# Altium schematic sheet Buffer.SchDoc
size A4
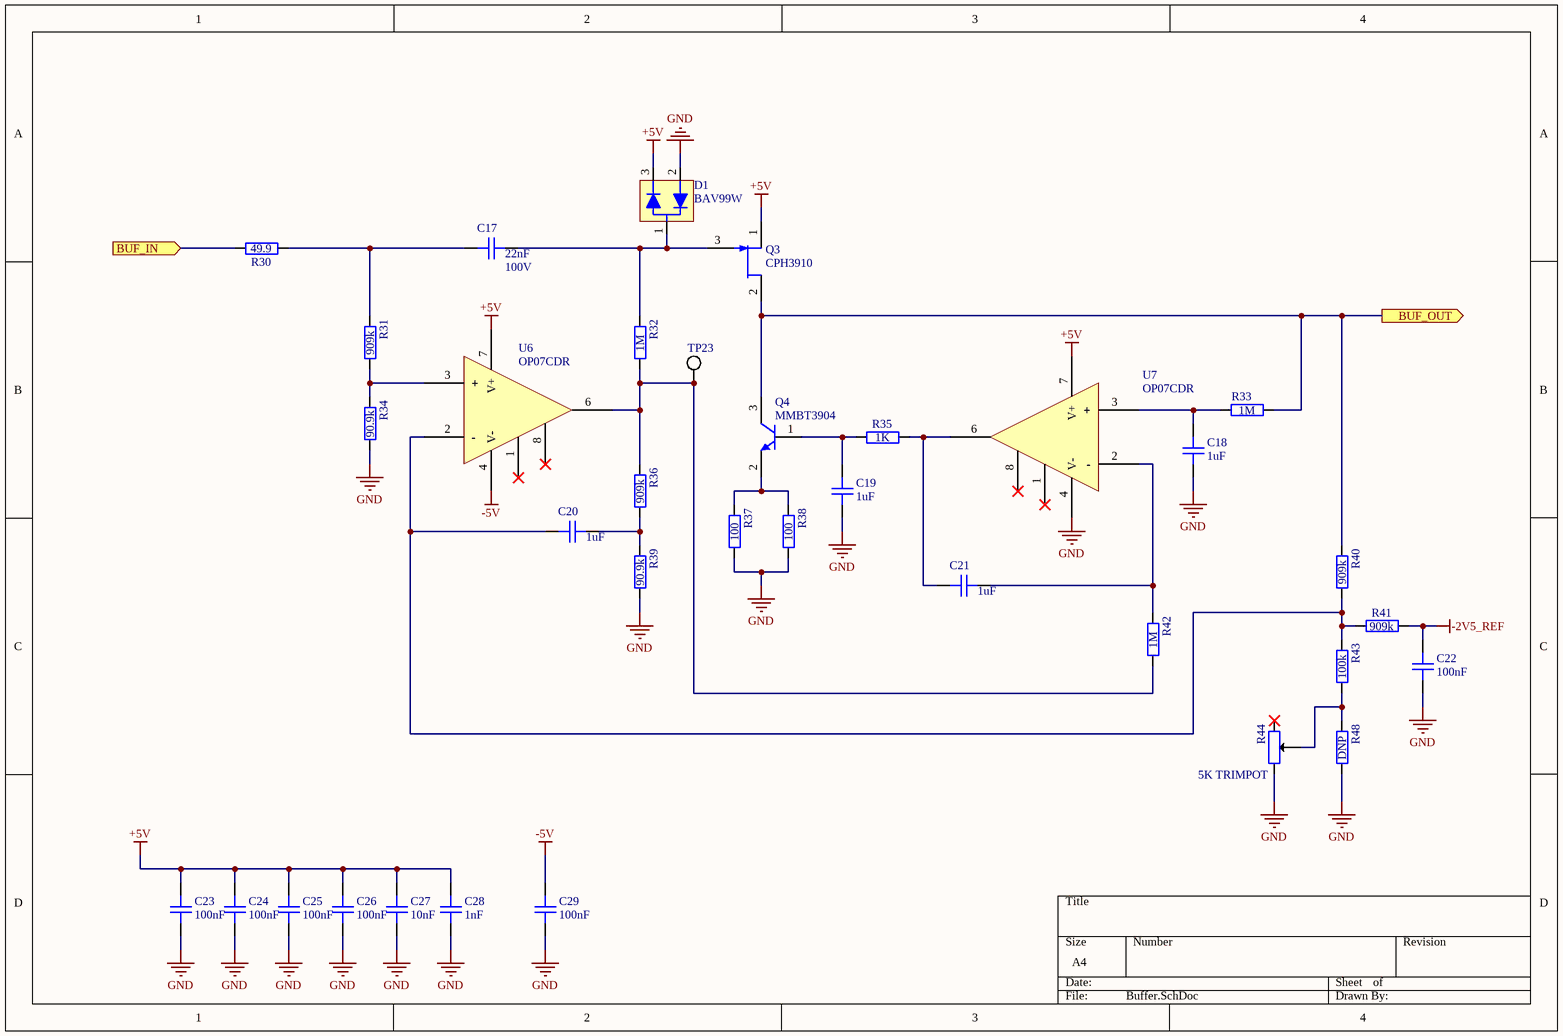
[diagram p0: Buffer.SchDoc]

## Parts
C17  22nF  Voltage Rating: 100V  [GEN_C_0603]
C18  1uF  [GEN_C_0402]
C19  1uF  [GEN_C_0402]
C20  1uF  [GEN_C_0402]
C21  1uF  [GEN_C_0402]
C22  100nF  [GEN_C_0402]
C23  100nF  [GEN_C_0402]
C24  100nF  [GEN_C_0402]
C25  100nF  [GEN_C_0402]
C26  100nF  [GEN_C_0402]
C27  10nF  [GEN_C_0402]
C28  1nF  [GEN_C_0402]
C29  100nF  [GEN_C_0402]
D1  BAV99W  [GEN_SOT_323]
Q3  CPH3910  [ON_SOT23_CPH3]
Q4  MMBT3904  [MMC_SOT23]
R30  49.9  [GEN_R_0402]
R31  909k  [GEN_R_0402]
R32  1M  [GEN_R_0402]
R33  1M  [GEN_R_0402]
R34  90.9k  [GEN_R_0402]
R35  1K  [GEN_R_0402]
R36  909k  [GEN_R_0402]
R37  100  [GEN_R_0402]
R38  100  [GEN_R_0402]
R39  90.9k  [GEN_R_0402]
R40  909k  [GEN_R_0402]
R41  909k  [GEN_R_0402]
R42  1M  [GEN_R_0402]
R43  100k  [GEN_R_0402]
R44  5K TRIMPOT  [BOU_3mm_POT]
R48  DNP  [GEN_R_0402]  (no BOM)
TP23  PCB  [GEN_TP_PCB]  (value not drawn)  (no BOM)
U6  OP07CDR  [TI_SOIC8_D0008A]
U7  OP07CDR  [TI_SOIC8_D0008A]

## Ports
BUF_IN (in), BUF_OUT (out)

## Nets
+5V: C23.1 C24.1 C25.1 C26.1 C27.2 C28.2 D1.3 Q3.1(S) U6.7(V+) U7.7(V+)
-2V5_REF: C22.1 R41.1
-5V: C29.1 U6.4(V-)
GND: C18.1 C19.1 C22.2 C23.2 C24.2 C25.2 C26.2 C27.1 C28.1 C29.2 D1.2 R34.1 R37.1 R38.1 R39.1 R44.3 R48.1 U7.4(V-)
BUF_IN: R30.1 ; port BUF_IN
BUF_OUT: Q3.2(D) Q4.3(C) R33.1 R40.2 ; port BUF_OUT
NetC17_1: C17.1 D1.1 Q3.3(G) R32.2
NetC17_2: C17.2 R30.2 R31.2
NetC18_2: C18.2 R33.2 U7.3(+)
NetC19_2: C19.2 Q4.1(B) R35.1
NetC20_1: C20.1 R36.1 R39.2
NetC20_2: C20.2 R40.1 R41.2 R43.2 U6.2(-)
NetC21_1: C21.1 R42.2 U7.2(-)
NetC21_2: C21.2 R35.2 U7.6(OUT)
NetQ4_2: Q4.2(E) R37.2 R38.2
NetR31_1: R31.1 R34.2 U6.3(+)
NetR32_1: R32.1 R36.2 R42.1 TP23.1 U6.6(OUT)
NetR43_1: R43.1 R44.2 R48.2

Not connected (* = marked no-connect by the designer): R44 1*; U6 1(N1)* 8(N2)*; U7 1(N1)* 8(N2)*

## Library data of the parts
C17 = CAP 22nF 100V X7R 0603: Package: 0603; Value: 22nF; Supplier 1: Digi-Key; Supplier Part Number 1: 490-4782-1-ND
C18-C21 = CAP 1uF 25V X5R 0402: Voltage Rating: 25V; Package: 0402; Supplier 1: Digi-Key; Supplier Part Number 1: 490-10017-1-ND; Value: 1uF
C22-C26 C29 = CAP 100nF 16V X7R 0402: Voltage Rating: 16V; Package: 0402; Supplier 1: Digi-Key; Supplier Part Number 1: 490-4759-1-ND; Value: 100nF
C27 = CAP 10nF 50V X7R 0402: Voltage Rating: 50V; Package: 0402; Supplier 1: Digi-Key; Supplier Part Number 1: 490-4762-1-ND; Value: 10nF
C28 = CAP 1nF 50V C0G 0402: Voltage Rating: 50V; Package: 0402; Supplier 1: Digi-Key; Supplier Part Number 1: 490-6189-1-ND; Value: 1nF
D1 = DIODE ARRAY BAV99W: Supplier 1: Digi-Key; Supplier Part Number 1: BAV99W-FDICT-ND
Q3 = NJFET CPH3910: Supplier 1: Digi-Key; Supplier Part Number 1: CPH3910-TL-EOSCT-ND
Q4 = NPN MMBT3904: Supplier 1: Digi-Key; Supplier Part Number 1: MMBT3904TPMSCT-ND
R30 = RES 49.9 OHM 1% 1/10W 0402: Tolerance: 1%; Power Rating: 0.1W; Package: 0402; Supplier 1: Digi-Key; Supplier Part Number 1: P49.9LCT-ND; Value: 49.9
R31 R36 R40 R41 = RES 909K OHM 1% 1/16W 0402: Tolerance: 1%; Power Rating: 0.0625W; Package: 0402; Supplier 1: Digi-Key; Supplier Part Number 1: YAG2377CT-ND; Value: 909k
R32 R33 R42 = RES 1M OHM 1% 1/10W 0402: Tolerance: 1%; Power Rating: 0.1W; Package: 0402; Supplier 1: Digi-Key; Supplier Part Number 1: P1.00MLCT-ND; Value: 1M
R34 R39 = RES 90.9K OHM 1% 1/16W 0402: Tolerance: 1%; Power Rating: 0.0625W; Package: 0402; Supplier 1: Digi-Key; Supplier Part Number 1: 311-90.9KLRCT-ND; Value: 90.9k
R35 = RES 1K OHM 1% 1/10W 0402: Tolerance: 1%; Power Rating: 0.1W; Package: 0402; Supplier 1: Digi-Key; Supplier Part Number 1: P1.00KLCT-ND; Value: 1K
R37 R38 = RES 100 OHM 1% 1/10W 0402: Tolerance: 1%; Power Rating: 0.1W; Package: 0402; Supplier 1: Digi-Key; Supplier Part Number 1: P100LCT-ND; Value: 100
R43 = RES 100K OHM 1% 1/10W 0402: Tolerance: 1%; Power Rating: 0.1W; Package: 0402; Supplier 1: Digi-Key; Supplier Part Number 1: P100KLCT-ND; Value: 100k
R44 = TRIMMER 5K OHM 0.1W J LEAD TOP: Tolerance: 1%; Power Rating: 0.1W; Supplier 1: Digi-Key; Supplier Part Number 1: TC33X-502ECT-ND; Value: 5K
R48 = RES DNP 0402: Tolerance: 1%; Power Rating: 0.0625W; Package: 0402; Value: DNP
TP23 = TP PCB 1mm
U6 U7 = IC OPAMP OP07CDR: Supplier 1: Digi-Key; Supplier Part Number 1: 296-14626-1-ND